# Altium schematic sheet hdmi.SchDoc
size A4
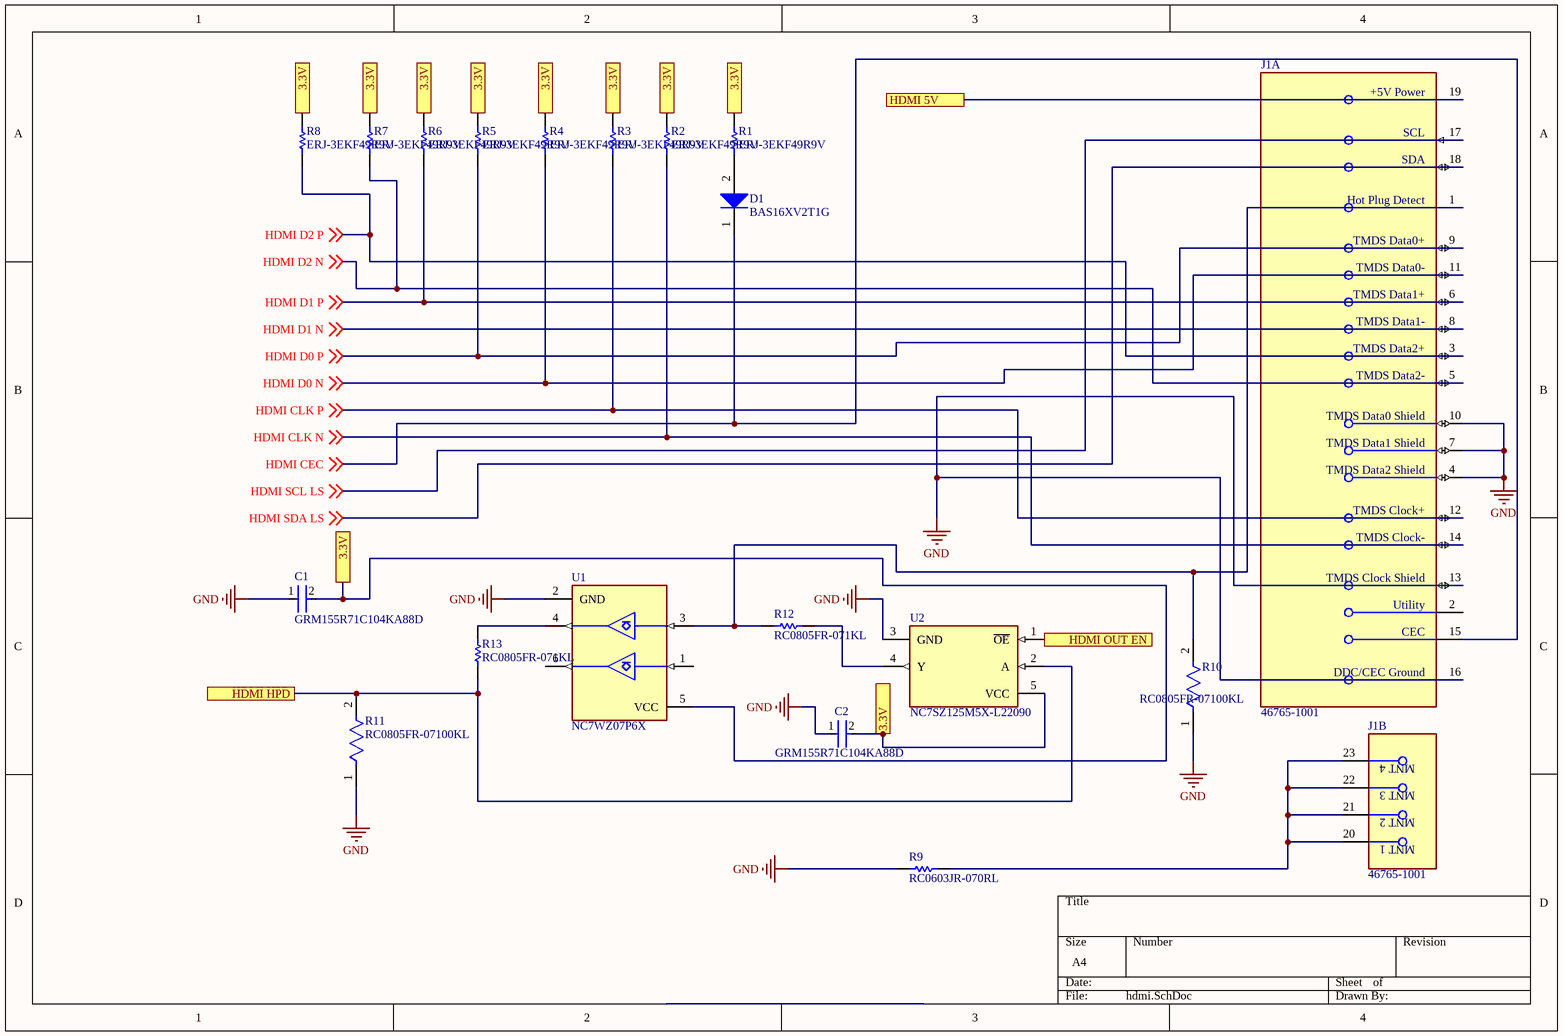
[diagram p0: hdmi.SchDoc]

## Parts
C1  GRM155R71C104KA88D  [FP-GRM15-MFG]
C2  GRM155R71C104KA88D  [FP-GRM15-MFG]
D1  BAS16XV2T1G  [ONSC-SOD-523-2-502-01_V]
J1  46765-1001  [FP-46765-1001-MFG]  (parts A,B of 2)
R1  ERJ-3EKF49R9V  [RESC1608X55X30ML15T15]
R2  ERJ-3EKF49R9V  [RESC1608X55X30ML15T15]
R3  ERJ-3EKF49R9V  [RESC1608X55X30ML15T15]
R4  ERJ-3EKF49R9V  [RESC1608X55X30ML15T15]
R5  ERJ-3EKF49R9V  [RESC1608X55X30ML15T15]
R6  ERJ-3EKF49R9V  [RESC1608X55X30ML15T15]
R7  ERJ-3EKF49R9V  [RESC1608X55X30ML15T15]
R8  ERJ-3EKF49R9V  [RESC1608X55X30ML15T15]
R9  RC0603JR-070RL  [RESC1608X55X25ML10T15]
R10  RC0805FR-07100KL  [FP-RC0805-0_6-IPC_C]
R11  RC0805FR-07100KL  [FP-RC0805-0_6-IPC_C]
R12  RC0805FR-071KL  [RESC2013X60X35ML10T20]
R13  RC0805FR-071KL  [RESC2013X60X35ML10T20]
U1  NC7WZ07P6X  [FP-419AD-01-MFG]
U2  NC7SZ125M5X-L22090  [FP-527AH-MFG]

## Ports
3.3V, HDMI 5V, HDMI HPD, HDMI OUT EN

## Nets
GND: C1.1 C2.1 J1.4(TMDS_Data2_Shield) J1.7(TMDS_Data1_Shield) J1.10(TMDS_Data0_Shield) J1.13(TMDS_Clock_Shield) J1.16(DDC/CEC_Ground) R9.1 R10.1 R11.1 U1.2(GND) U2.3(GND)
3.3V: C1.2 C2.2 R1.2 R2.2 R3.2 R4.2 R5.2 R6.2 R7.2 R8.2 U1.5(VCC) U2.5(VCC) ; port 3.3V
HDMI 5V: J1.19(+5V_Power) ; port HDMI 5V
HDMI CEC: D1.1(K) J1.15(CEC) ; off-sheet HDMI CEC
HDMI CLK N: J1.14(TMDS_Clock-) R2.1 ; off-sheet HDMI CLK N
HDMI CLK P: J1.12(TMDS_Clock+) R3.1 ; off-sheet HDMI CLK P
HDMI D0 N: J1.11(TMDS_Data0-) R4.1 ; off-sheet HDMI D0 N
HDMI D0 P: J1.9(TMDS_Data0+) R5.1 ; off-sheet HDMI D0 P
HDMI D1 N: J1.8(TMDS_Data1-) ; off-sheet HDMI D1 N
HDMI D1 P: J1.6(TMDS_Data1+) R6.1 ; off-sheet HDMI D1 P
HDMI D2 N: J1.5(TMDS_Data2-) R7.1 ; off-sheet HDMI D2 N
HDMI D2 P: J1.3(TMDS_Data2+) R8.1 ; off-sheet HDMI D2 P
HDMI HPD: R11.2 R13.1 U2.2(A) ; port HDMI HPD
HDMI OUT EN: U2.1(~{OE}) ; port HDMI OUT EN
HDMI SCL LS: J1.17(SCL) ; off-sheet HDMI SCL LS
HDMI SDA LS: J1.18(SDA) ; off-sheet HDMI SDA LS
NetD1_2: D1.2(A) R1.1
NetJ1_1: J1.1(Hot_Plug_Detect) R10.2 R12.2 U1.3(A2)
NetJ1_20: J1.20(MNT_1) J1.21(MNT_2) J1.22(MNT_3) J1.23(MNT_4) R9.2
NetR12_1: R12.1 U2.4(Y)
NetR13_2: R13.2 U1.4(Y2)

Not connected (* = marked no-connect by the designer): J1 2(Utility); U1 1(A1) 6(Y1)

## Library data of the parts
C1 C2 = CMP-2100-03641-2: CAP CER 0.1UF 16V X7R 0402; Manufacturer: Murata; Standoff Height: 0mm; Tolerance: 10%; Voltage Rating: 16Vdc; Material: Ceramic; Capacitance: 0.10μF; Value: 0.10μF; RoHS: TRUE; Manufacturer Part Number: GRM155R71C104KA88D; Temperature Characteristic: X7R; Octopart: https://octopart.com/grm155r71c104ka88d-murata-196880; Digikey Description: CAP CER 0.1UF 16V X7R 0402; Device Class L3: Ceramic Capacitors; Height: 0.55mm; ComponentLink2Description: Datasheet; Temperature Range Low: -55°C; Ipc Land Pattern Name: CAPC10050X219; ComponentLink2URL: https://search.murata.co.jp/Ceramy/image/img/A01X/G101/ENG/GRM155R71H471KA01-01A.pdf; Device Class L1: Passive Components; Lead Free: yes; Category: Cap; Package: GRM15; Temperature: -55°C to +125°C; Device Class L2: Capacitors; Temperature Range High: +125°C; Mouser Description: 0402 0.1 uF 16V ±10 % Tolerance X7R SMT Multilayer Ceramic Capacitor
D1 = CMP-1054-00076-1: Switching Diode, 2-Pin SOD-523, Pb-Free, Tape and Reel; Manufacturer: On Semiconductor; trr Max (ns): 6; Configuration: Single; IF Max (A): 0.2; ComponentLink1URL: http://www.onsemi.com/; DatasheetVersion: Rev. 7; RoHS: TRUE; PackageVersion: Rev. E, 09/2010; Packing: Tape and Reel; ComponentLink2Description: Datasheet; ComponentLink2URL: http://www.onsemi.com/pub_link/Collateral/BAS16XV2T1-D.PDF; ComponentLink3Description: Package Specification; PackageReference: SOD-523-2-502-01; ComponentLink1Description: Manufacturer URL; PartNumber: BAS16XV2T1G; Mounting Technology: Surface Mount; PackageDescription: 2-Pin SOD, Body 1.2 x 0.8 mm; ComponentLink3URL: http://www.onsemi.com/pub_link/Collateral/502-01.PDF
J1 = CMP-04768-000007-1: CONN RCP MICRO HDMI 19POS SMD RA; Voltage Rating: 30V; Pitch: 0.4mm; Number of Terminals/Pins: 19; Number of Ports: 1; Current Rating: 800mA; Gender: Receptacle; Body Material: Plastic; Min Operating Temperature: -30°C; Series: 46765; Contact Material: Copper Alloy; Contact Plating: Gold; Connector Type: HDMI; Mount: Surface Mount; Termination: Solder; Package Quantity: 1000; Flammability Rating: UL94 V-0; Packaging: Tape and Reel; Length: 6.5mm; Number of Positions: 19; Number of Contacts: 19; Weight: 0.0109oz; Max Current Rating: 800mA; Case/Package: Metal; Housing Material: Polymer; RoHS Compliant: Yes; Max Operating Temperature: 85°C; Orientation: Right Angle; Depth: 7.5mm; Width: 7mm
R1-R8 = CMP-2000-00538-1: Manufacturer: Panasonic; Part Number: ERJ-3EKF49R9V
R9 = CMP-2100-03667-1: Chip Resistor, 0 Ohm, +/- 5%, 0.1 W, -55 to 155 degC, 0603 (1608 Metric), RoHS, Tape and Reel; Manufacturer: Yageo; Temperature Coefficient: 200ppm/degreesC; Voltage Rating: 50V; Power Rating: 100mW; Resistance: 0mOhm; Width: 0.8mm; Max Operating Temperature: 155degC; Tolerance: 5%; Package Reference: 0603; Height: 0.45mm; Depth: 0.8mm; Package Description: 2-Pin Surface Mount Device, Body 1.6 x 0.8 mm; Termination: SMD/SMT; Package Quantity: 5000; Case/Package: 0603; Case Code (Imperial): 0603; Radiation Hardening: No; Number of Pins: 2; Length: 1.6mm; Lead Free: LeadFree; Voltage Rating (DC): 50V; Military Standard: Not; Datasheet URL: http://www.yageo.com/NewPortal/yageodocoutput?fileName=/pdf/R-Chip/PYu-RC_Group_51_RoHS_L_5.pdf; Manufacturer URL: http://www.yageo.com/; Packaging: TapeandReel; Case Code (Metric): 1608; Min Operating Temperature: -55degC; Composition: ThickFilm; RoHSCompliant: true; Contact Plating: Tin; Datasheet Version: Rev. 5, 10/2016; REACH SVHC: NoSVHC
R10 R11 = CMP-2100-03668-5: RES 100K OHM 1% 1/8W 0805; Power Rating: 125mW; Temperature Coefficient: 100ppm/°C; Voltage Rating (DC): 150V; Resistance: 100kR; Package Quantity: 1; Case/Package: 0805; Lead Pitch: 0.4mm; Case Code (Imperial): 0805; Construction: Rectangular; Number of Terminations: 2; RoHS Compliant: Yes; Max Power Dissipation: 125mW; Tolerance: 1%; Max Operating Temperature: 155°C; Resistance Tolerance: 1%; Lead Free: Lead Free; Packaging: Tape and Reel; Resistor Type: Thick Film; Min Operating Temperature: -55°C; Case Code (Metric): 2012; Series: RC; Technology: THICK FILM; Voltage Rating: 150V; Termination: SMD/SMT; Width: 0.049inch; Number of Pins: 2; Features: Moisture Resistant; Military Standard: Not; Length: 0.079inch; Depth: 1.25mm; Size Code: 0805; Height: 0.024inch
R12 R13 = CMP-2100-03671-1: Chip Resistor, 1 KOhm, +/- 1%, 125 mW, -55 to 155 degC, 0805 (2012 Metric), RoHS, Tape and Reel; Manufacturer: Yageo; Temperature Coefficient: 100ppm/degreesC; Voltage Rating (DC): 150V; Max Power Dissipation: 125mW; Resistance: 1KOhm; Number of Pins: 2; Number of Terminations: 2; Datasheet URL: http://www.yageo.com/NewPortal/yageodocoutput?fileName=/pdf/R-Chip/PYu-RC_Group_51_RoHS_L_5.pdf; Length: 0.079inch; Package Description: 2-Pin Surface Mounted Device, Body 2 x 1.25 mm; Depth: 1.25mm; Height: 0.024inch; Military Standard: Not; Case/Package: 0805; Package Reference: 0805; RoHSCompliant: true; Lead Free: LeadFree; Packaging: TapeandReel; Package Quantity: 1; Datasheet Version: Rev. 5, 10/2016; Tolerance: 1%; Min Operating Temperature: -55degC; Voltage Rating: 150V; Composition: ThickFilm; Case Code (Imperial): 0805; Power Rating: 125mW; Width: 0.049inch; Case Code (Metric): 2012; Manufacturer URL: http://www.yageo.com/; Max Operating Temperature: 155degC; REACH SVHC: Unknown; Termination: SMD/SMT
U1 = CMP-2000-06822-2: IC BUF NON-INVERT 5.5V SC70-6; Propagation Delay: 12.6ns; Max Power Dissipation: 180mW; High Level Output Current: 32mA; Number of Outputs: 2; Number of Bits per Element: 1; Polarity: Non-Inverting; Max Supply Current: 24mA; Turn-On Delay Time: 11.5ns; Logic Function: Buffer; Min Supply Voltage: 1.65V; Quiescent Current: 1uA; REACH SVHC: No SVHC; Lead Free: Lead Free; Packaging: Tape and Reel; Low Level Output Current: 32mA; Number of Channels: 2; Number of Output Lines: 2; Number of Bits: 2; Min Operating Temperature: -40°C; Radiation Hardening: No; Number of Elements: 2; Number of Pins: 6; Number of Inputs: 2; Max Supply Voltage: 5.5V; Package Quantity: 1; Termination: SMD/SMT; Number of Input Lines: 2; Number of Circuits: 2; Weight: 0.028g; Max Operating Temperature: 85°C; Case/Package: SC; Length: 2mm; Width: 1.25mm; Mount: Surface Mount; Height: 1mm
U2 = CMP-00278-126810840-1: NC7SZ125M5X-L22090 NC7SZ125 Series 5.5 V TinyLogic UHS Single Buffer w/ 3-State Output - SOT-23-5; Manufacturer Lifecycle Status: LIFETIME; Min Supply Voltage: 1.65V; Quiescent Current: 2µA; Max Junction Temperature (Tj): 150°C; Max Supply Voltage: 5.5V; Number of Outputs: 1; Propagation Delay: 2.6ns; Min Operating Temperature: -40°C; Height: 1.45mm; Lifecycle Status: Production; NexarPartId: 126810840; Max Operating Temperature: 85°C; Number of Circuits: 1; Number of Inputs: 1